# EasyEDA schematic SCH_TauKeyboard-87keys.SchDoc_2023-11-22.json

## Parts
C2  47uF  [3528_C]
C3  2.2uF  [0402_C]
C5  0.1uF  [0402_C]
C6  2.2uF  [0603_C]
C7  2.2uF  [0402_C]
C8  2.2uF  [0603_C]
C9  2.2uF  [0603_C]
C10  20pF  [0603_C]
C11  0.1uF  [0603_C]
C12  33uF  [3528_C]
C13  10uF  [3216_C]
C14  0.1uF  [0603_C]
D1  DIODE  [3216+]
D2  DIODE  [3216+]
D3  DIODE  [3216+]
D4  DIODE  [3216+]
D5  DIODE  [3216+]
D6  DIODE  [3216+]
D7  DIODE  [3216+]
D8  DIODE  [3216+]
D9  DIODE  [3216+]
D10  DIODE  [3216+]
D11  DIODE  [3216+]
D12  DIODE  [3216+]
D13  DIODE  [3216+]
D14  DIODE  [3216+]
D15  DIODE  [3216+]
D16  DIODE  [3216+]
D17  DIODE  [3216+]
D18  DIODE  [3216+]
D19  DIODE  [3216+]
D20  DIODE  [3216+]
D21  DIODE  [3216+]
D22  1N5817  [7227+]
D23  DIODE  [3216+]
D24  1N5817  [7227+]
D25  DIODE  [3216+]
D26  1N5817  [7227+]
D27  DIODE  [3216+]
D28  DIODE  [3216+]
D29  DIODE  [3216+]
D30  DIODE  [3216+]
D31  DIODE  [3216+]
D32  DIODE  [3216+]
D33  DIODE  [3216+]
D34  DIODE  [3216+]
D35  DIODE  [3216+]
D36  DIODE  [3216+]
D37  DIODE  [3216+]
D38  DIODE  [3216+]
D39  DIODE  [3216+]
D40  DIODE  [3216+]
D41  DIODE  [3216+]
D42  DIODE  [3216+]
D43  DIODE  [3216+]
D44  DIODE  [3216+]
D45  DIODE  [3216+]
D46  DIODE  [3216+]
D47  DIODE  [3216+]
D48  DIODE  [3216+]
D49  DIODE  [3216+]
D50  DIODE  [3216+]
D51  DIODE  [3216+]
D52  DIODE  [3216+]
D53  DIODE  [3216+]
D54  DIODE  [3216+]
D55  DIODE  [3216+]
D56  DIODE  [3216+]
D57  DIODE  [3216+]
D58  DIODE  [3216+]
D59  DIODE  [3216+]
D60  DIODE  [3216+]
D61  DIODE  [3216+]
D62  DIODE  [3216+]
D63  DIODE  [3216+]
D64  DIODE  [3216+]
D65  DIODE  [3216+]
D66  DIODE  [3216+]
D67  DIODE  [3216+]
D68  DIODE  [3216+]
D69  DIODE  [3216+]
D70  DIODE  [3216+]
D71  DIODE  [3216+]
D72  DIODE  [3216+]
D73  DIODE  [3216+]
D74  DIODE  [3216+]
D75  DIODE  [3216+]
D76  DIODE  [3216+]
D77  DIODE  [3216+]
D78  DIODE  [3216+]
D79  DIODE  [3216+]
D80  DIODE  [3216+]
D81  DIODE  [3216+]
D82  DIODE  [3216+]
D83  DIODE  [3216+]
D84  DIODE  [3216+]
D85  DIODE  [3216+]
D86  DIODE  [3216+]
D87  DIODE  [3216+]
D88  DIODE  [3216+]
D89  DIODE  [3216+]
D90  DIODE  [3216+]
D199  LED  [0603+]
D227  LED  [0603+]
D228  LED  [0603+]
D229  LED  [0603+]
E1  ANTENNA  [ANT-F-1-2.4G-1.6]
J1  电源  [SIP2-2.54MM]
L1  22uH  [SMD_7.3X7.8MM]
L2  22uH  [SMD_2X2MM]
L4  3.3uH  [SMD_5X5MM]
LD7  LED  [0603+]
LD8  LED  [0603+]
LD9  LED  [0603+]
LD10  LED  [0603+]
LD11  LED  [0603+]
LD12  LED  [0603+]
LD13  LED  [0603+]
LD14  LED  [0603+]
LD15  LED  [0603+]
LD16  LED  [0603+]
LD17  LED  [0603+]
LD18  LED  [0603+]
LD19  LED  [0603+]
LD21  LED  [0603+]
LD22  LED  [0603+]
LD23  LED  [0603+]
LD52  LED  [0603+]
LD53  LED  [0603+]
LD54  LED  [0603+]
LD55  LED  [0603+]
LD56  LED  [0603+]
LD57  LED  [0603+]
LD58  LED  [0603+]
LD59  LED  [0603+]
LD60  LED  [0603+]
LD61  LED  [0603+]
LD62  LED  [0603+]
LD63  LED  [0603+]
LD64  LED  [0603+]
LD65  LED  [0603+]
LD66  LED  [0603+]
LD67  LED  [0603+]
LD68  LED  [0603+]
LD93  LED  [0603+]
LD94  LED  [0603+]
LD95  LED  [0603+]
LD96  LED  [0603+]
LD97  LED  [0603+]
LD98  LED  [0603+]
LD99  LED  [0603+]
LD100  LED  [0603+]
LD101  LED  [0603+]
LD102  LED  [0603+]
LD103  LED  [0603+]
LD104  LED  [0603+]
LD105  LED  [0603+]
LD106  LED  [0603+]
LD107  LED  [0603+]
LD108  LED  [0603+]
LD109  LED  [0603+]
LD140  LED  [0603+]
LD141  LED  [0603+]
LD142  LED  [0603+]
LD143  LED  [0603+]
LD144  LED  [0603+]
LD145  LED  [0603+]
LD146  LED  [0603+]
LD147  LED  [0603+]
LD148  LED  [0603+]
LD149  LED  [0603+]
LD150  LED  [0603+]
LD151  LED  [0603+]
LD186  LED  [0603+]
LD187  LED  [0603+]
LD188  LED  [0603+]
LD189  LED  [0603+]
LD190  LED  [0603+]
LD191  LED  [0603+]
LD192  LED  [0603+]
LD193  LED  [0603+]
LD194  LED  [0603+]
LD195  LED  [0603+]
LD196  LED  [0603+]
LD197  LED  [0603+]
LD216  LED  [0603+]
LD217  LED  [0603+]
LD218  LED  [0603+]
LD219  LED  [0603+]
LD220  LED  [0603+]
LD223  LED  [0603+]
LD224  LED  [0603+]
LD230  LED  [0603+]
LD231  LED  [0603+]
LD232  LED  [0603+]
LD_FN  LED  [0603+]
P6  Header 2  [SIP2-2.54MM]
P7  Header 4  [HDR1X4]
P7#2  Header 2  [SIP2-2.54MM]
P9  TYPE-C  [TYPE-C-RECEPTACLE-2.0]
Q1  MOSFET P  [SOT-23]
Q2  MOSFET P  [SOT-23]
Q3  MOSFET P  [SOT-23]
Q4  MOSFET P  [SOT-23]
Q5  MOSFET P  [SOT-23]
Q6  MOSFET P  [SOT-23]
R1  0R  [0603]
R2  0R  [0603]
R3  0R  [0603]
R4  0R  [0603]
R5  0R  [0603]
R6  0R  [0603]
R7  0R  [0603]
R8  0R  [0603]
R9  0R  [0603]
R10  0R  [0603]
R10#2  NC(5.1K)  [0603]
R11  0R  [0603]
R11#2  NC(5.1K)  [0603]
R12  0R  [0603]
R13  0R  [0603]
R14  0R  [0603]
R16  0R  [0603]
R17  0R  [0603]
R18  0R  [0603]
R24  0R  [0603]
R25  0R  [0603]
R26  0R  [0603]
R27  0R  [0603]
R28  0R  [0603]
R29  0R  [0603]
R30  0R  [0603]
R31  0R  [0603]
R32  0R  [0603]
R33  0R  [0603]
R34  0R  [0603]
R35  0R  [0603]
R36  0R  [0603]
R37  0R  [0603]
R38  0R  [0603]
R39  0R  [0603]
R40  0R  [0603]
R41  0R  [0603]
R47  0R  [0603]
R48  0R  [0603]
R49  0R  [0603]
R50  0R  [0603]
R51  0R  [0603]
R52  0R  [0603]
R53  0R  [0603]
R54  0R  [0603]
R55  0R  [0603]
R56  0R  [0603]
R57  0R  [0603]
R58  0R  [0603]
R59  0R  [0603]
R60  0R  [0603]
R61  0R  [0603]
R62  0R  [0603]
R63  0R  [0603]
R64  0R  [0603]
R70  0R  [0603]
R72  0R  [0603]
R73  0R  [0603]
R74  0R  [0603]
R75  0R  [0603]
R76  0R  [0603]
R77  0R  [0603]
R78  0R  [0603]
R79  0R  [0603]
R80  0R  [0603]
R81  0R  [0603]
R82  0R  [0603]
R83  0R  [0603]
R90  0R  [0603]
R91  0R  [0603]
R92  0R  [0603]
R93  0R  [0603]
R94  0R  [0603]
R95  0R  [0603]
R96  0R  [0603]
R97  0R  [0603]
R98  0R  [0603]
R99  0R  [0603]
R100  0R  [0603]
R101  0R  [0603]
R102  0R  [0603]
R104  0R  [0603]
R110  0R  [0603]
R111  0R  [0603]
R112  0R  [0603]
R113  0R  [0603]
R114  0R  [0603]
R115  0R  [0603]
R117  1K  [0603]
R118  0R  [0603]
R119  0R  [0603]
R120  10K  [0603]
R121  1M  [0603]
R122  0R  [0603]
R123  0R  [0603]
R124  0R  [0603]
R126  1K  [0603]
R127  1K  [0603]
R128  10K  [0603]
R129  1M  [0603]
R131  47K  [0603]
R133  10K  [0603]
R135  1K  [0603]
R300  10K  [0603]
R_FN  0R  [0603]
RJ1  10K  [0603]
RJ2  10K  [0603]
RJ3  10K  [0603]
RJ4  10K  [0603]
RJ5  10K  [0603]
RJ6  10K  [0603]
RJ7  10K  [0603]
RJ8  10K  [0603]
RJ9  10K  [0603]
RJ10  10K  [0603]
RJ11  10K  [0603]
RJ12  10K  [0603]
RJ13  10K  [0603]
RJ14  10K  [0603]
RJ15  10K  [0603]
RJ16  10K  [0603]
RJ17  10K  [0603]
S1  SW-PB  [SMD_6.1X3.65X2.5MM-KEY]
S2  SW-PB  [SMD_6.1X3.65X2.5MM-KEY]
S3  SW-PB  [SMD_6.1X3.65X2.5MM-KEY]
S4  SW-PB  [SMD_6.1X3.65X2.5MM-KEY]
S5  SW-PB  [SMD_6.1X3.65X2.5MM-KEY]
S6  SW-PB  [SMD_6.1X3.65X2.5MM-KEY]
S7  SW-PB  [SMD_6.1X3.65X2.5MM-KEY]
S8  SW-PB  [SMD_6.1X3.65X2.5MM-KEY]
S9  SW-PB  [SMD_6.1X3.65X2.5MM-KEY]
S10  SW-PB  [SMD_6.1X3.65X2.5MM-KEY]
S11  SW-PB  [SMD_6.1X3.65X2.5MM-KEY]
S12  SW-PB  [SMD_6.1X3.65X2.5MM-KEY]
S13  SW-PB  [SMD_6.1X3.65X2.5MM-KEY]
S14  SW-PB  [SMD_6.1X3.65X2.5MM-KEY]
S15  SW-PB  [SMD_6.1X3.65X2.5MM-KEY]
S16  SW-PB  [SMD_6.1X3.65X2.5MM-KEY]
S17  SW-PB  [SMD_6.1X3.65X2.5MM-KEY]
S18  SW-PB  [SMD_6.1X3.65X2.5MM-KEY]
S19  SW-PB  [SMD_6.1X3.65X2.5MM-KEY]
S20  SW-PB  [SMD_6.1X3.65X2.5MM-KEY]
S21  SW-PB  [SMD_6.1X3.65X2.5MM-KEY]
S22  SW-PB  [SMD_6.1X3.65X2.5MM-KEY]
S23  SW-PB  [SMD_6.1X3.65X2.5MM-KEY]
S24  SW-PB  [SMD_6.1X3.65X2.5MM-KEY]
S25  SW-PB  [SMD_6.1X3.65X2.5MM-KEY]
S26  SW-PB  [SMD_6.1X3.65X2.5MM-KEY]
S27  SW-PB  [SMD_6.1X3.65X2.5MM-KEY]
S28  SW-PB  [SMD_6.1X3.65X2.5MM-KEY]
S29  SW-PB  [SMD_6.1X3.65X2.5MM-KEY]
S30  SW-PB  [SMD_6.1X3.65X2.5MM-KEY]
S31  SW-PB  [SMD_6.1X3.65X2.5MM-KEY]
S32  SW-PB  [SMD_6.1X3.65X2.5MM-KEY]
S33  SW-PB  [SMD_6.1X3.65X2.5MM-KEY]
S34  SW-PB  [SMD_6.1X3.65X2.5MM-KEY]
S35  SW-PB  [SMD_6.1X3.65X2.5MM-KEY]
S36  SW-PB  [SMD_6.1X3.65X2.5MM-KEY]
S37  SW-PB  [SMD_6.1X3.65X2.5MM-KEY]
S38  SW-PB  [SMD_6.1X3.65X2.5MM-KEY]
S39  SW-PB  [SMD_6.1X3.65X2.5MM-KEY]
S40  SW-PB  [SMD_6.1X3.65X2.5MM-KEY]
S41  SW-PB  [SMD_6.1X3.65X2.5MM-KEY]
S42  SW-PB  [SMD_6.1X3.65X2.5MM-KEY]
S43  SW-PB  [SMD_6.1X3.65X2.5MM-KEY]
S44  SW-PB  [SMD_6.1X3.65X2.5MM-KEY]
S45  SW-PB  [SMD_6.1X3.65X2.5MM-KEY]
S46  SW-PB  [SMD_6.1X3.65X2.5MM-KEY]
S47  SW-PB  [SMD_6.1X3.65X2.5MM-KEY]
S48  SW-PB  [SMD_6.1X3.65X2.5MM-KEY]
S49  SW-PB  [SMD_6.1X3.65X2.5MM-KEY]
S50  SW-PB  [SMD_6.1X3.65X2.5MM-KEY]
S51  SW-PB  [SMD_6.1X3.65X2.5MM-KEY]
S52  SW-PB  [SMD_6.1X3.65X2.5MM-KEY]
S53  SW-PB  [SMD_6.1X3.65X2.5MM-KEY]
S54  SW-PB  [SMD_6.1X3.65X2.5MM-KEY]
S55  SW-PB  [SMD_6.1X3.65X2.5MM-KEY]
S56  SW-PB  [SMD_6.1X3.65X2.5MM-KEY]
S57  SW-PB  [SMD_6.1X3.65X2.5MM-KEY]
S58  SW-PB  [SMD_6.1X3.65X2.5MM-KEY]
S59  SW-PB  [SMD_6.1X3.65X2.5MM-KEY]
S60  SW-PB  [SMD_6.1X3.65X2.5MM-KEY]
S61  SW-PB  [SMD_6.1X3.65X2.5MM-KEY]
S62  SW-PB  [SMD_6.1X3.65X2.5MM-KEY]
S63  SW-PB  [SMD_6.1X3.65X2.5MM-KEY]
S64  SW-PB  [SMD_6.1X3.65X2.5MM-KEY]
S65  SW-PB  [SMD_6.1X3.65X2.5MM-KEY]
S66  SW-PB  [SMD_6.1X3.65X2.5MM-KEY]
S67  SW-PB  [SMD_6.1X3.65X2.5MM-KEY]
S68  SW-PB  [SMD_6.1X3.65X2.5MM-KEY]
S69  SW-PB  [SMD_6.1X3.65X2.5MM-KEY]
S70  Download  [____]
S71  SW-PB  [SMD_6.1X3.65X2.5MM-KEY]
S72  SW-PB  [SMD_6.1X3.65X2.5MM-KEY]
S73  SW-PB  [SMD_6.1X3.65X2.5MM-KEY]
S74  SW-PB  [SMD_6.1X3.65X2.5MM-KEY]
S75  SW-PB  [SMD_6.1X3.65X2.5MM-KEY]
S76  SW-PB  [SMD_6.1X3.65X2.5MM-KEY]
S77  SW-PB  [SMD_6.1X3.65X2.5MM-KEY]
S78  SW-PB  [SMD_6.1X3.65X2.5MM-KEY]
S79  SW-PB  [SMD_6.1X3.65X2.5MM-KEY]
S80  SW-PB  [SMD_6.1X3.65X2.5MM-KEY]
S81  SW-PB  [SMD_6.1X3.65X2.5MM-KEY]
S82  SW-PB  [SMD_6.1X3.65X2.5MM-KEY]
S83  SW-PB  [SMD_6.1X3.65X2.5MM-KEY]
S84  SW-PB  [SMD_6.1X3.65X2.5MM-KEY]
S85  SW-PB  [SMD_6.1X3.65X2.5MM-KEY]
S86  SW-PB  [SMD_6.1X3.65X2.5MM-KEY]
S87  SW-PB  [SMD_6.1X3.65X2.5MM-KEY]
S_FN1  SW-PB  [SMD_6.1X3.65X2.5MM-KEY]
U1  CE8301C33M  [SOT-23-5]
U2  CH582M  [QFN48_5X5]
U3  CE8502AM  [SOT-23-5]
Y1  32M  [XT3225]
Y2  32.768K  [FC-135]

## Library data of the parts
D22 D24 D26 = -: Published: 8-Jun-2000; LatestRevisionDate: 17-Jul-2002; LatestRevisionNote: Re-released for DXP Platform.; PackageReference: SMB; Publisher: Altium Limited; Code_JEDEC: DO-214-AA
L1 = -: 物料代码: 1.05.0226.04; 物料名称: 电感; Value2: 额定电流600mA; Value3: 顺络
P6 P7 P7#2 = -: LatestRevisionDate: 17-Jul-2002; LatestRevisionNote: Re-released for DXP Platform.; Publisher: Altium Limited
RJ1-RJ17 = -: Published: 8-Jun-2000; LatestRevisionDate: 17-Jul-2002; LatestRevisionNote: Re-released for DXP Platform.; PackageReference: AXIAL-0.4; Publisher: Altium Limited
S70 = -: Published: 24-Mar-1999; LatestRevisionDate: 17-Jul-2002; LatestRevisionNote: Re-released for DXP Platform.; PackageReference: SPST-2; Publisher: Altium Limited; PackageDescription: Switch; 2 Leads
U1 = -: 物料代码: 1.07.0021.05; 物料名称: IC
Y1 Y2 = -: Published: 8-Jun-2000; LatestRevisionDate: 17-Jul-2002; LatestRevisionNote: Re-released for DXP Platform.; PackageReference: R38; Publisher: Altium Limited; PackageDescription: Crystal, Thru-Hole; 2 Leads; Body 3.1 x 8.2 mm (Dia.xH)

## Nets
+3V3: C6.2 D24.2(K) D26.2(K) LD230.A(1) LD231.A(1) LD232.A(1) P7.1 R300.2 U2.3(VIO33/VDD33)
+5V: C13.1 D199.A(1) D227.A(1) D228.A(1) D229.A(1) LD7.A(1) LD8.A(1) LD9.A(1) LD10.A(1) LD11.A(1) LD12.A(1) LD13.A(1) LD14.A(1) LD15.A(1) LD16.A(1) LD17.A(1) LD18.A(1) LD19.A(1) LD21.A(1) LD22.A(1) LD23.A(1) LD52.A(1) LD53.A(1) LD54.A(1) LD55.A(1) LD56.A(1) LD57.A(1) LD58.A(1) LD59.A(1) LD60.A(1) LD61.A(1) LD62.A(1) LD63.A(1) LD64.A(1) LD65.A(1) LD66.A(1) LD67.A(1) LD68.A(1) LD93.A(1) LD94.A(1) LD95.A(1) LD96.A(1) LD97.A(1) LD98.A(1) LD99.A(1) LD100.A(1) LD101.A(1) LD102.A(1) LD103.A(1) LD104.A(1) LD105.A(1) LD106.A(1) LD107.A(1) LD108.A(1) LD109.A(1) LD140.A(1) LD141.A(1) LD142.A(1) LD143.A(1) LD144.A(1) LD145.A(1) LD146.A(1) LD147.A(1) LD148.A(1) LD149.A(1) LD150.A(1) LD151.A(1) LD186.A(1) LD187.A(1) LD188.A(1) LD189.A(1) LD190.A(1) LD191.A(1) LD192.A(1) LD193.A(1) LD194.A(1) LD195.A(1) LD196.A(1) LD197.A(1) LD216.A(1) LD217.A(1) LD218.A(1) LD219.A(1) LD220.A(1) LD223.A(1) LD224.A(1) LD_FN.A(1) P9.A4(VBUS) P9.B4(VBUS) R120.2 U3.1(RUN) U3.4(VIN)
VINTA: C7.2 U2.33(VINTA)
BT+: C2.2 J1.2 L1.1 R117.2 R121.2
BT-: C2.1 C3.1 C5.1 C6.1 C7.1 C8.1 C9.1 C11.2 C12.2 C13.2 C14.1 J1.1 P7.4 P7#2.2 P9.A1(GND) P9.B1(GND) Q1.3(D) Q2.3(D) Q3.3(D) Q4.3(D) Q5.3(D) Q6.3(D) R10#2.2 R11#2.2 R128.1 R129.1 R133.1 RJ1.1 RJ2.1 RJ3.1 RJ4.1 RJ5.1 RJ6.1 RJ7.1 RJ8.1 RJ9.1 RJ10.1 RJ11.1 RJ12.1 RJ13.1 RJ14.1 RJ15.1 RJ16.1 RJ17.1 U1.4(GND) U2.0(GND) U3.2(GND)
CL0: D1.2(K) D7.2(K) D13.2(K) D19.2(K) D28.2(K) D34.2(K) RJ1.2 U2.20(PB4/RXD0/PWM7)
CL1: D2.2(K) D8.2(K) D14.2(K) D20.2(K) D29.2(K) D35.2(K) RJ2.2 U2.19(PB5/DTR)
CL2: D3.2(K) D9.2(K) D15.2(K) D21.2(K) D30.2(K) D36.2(K) RJ3.2 U2.18(PB6/RTS/PWM8)
CL3: D4.2(K) D10.2(K) D16.2(K) D23.2(K) D31.2(K) D37.2(K) RJ4.2 U2.17(PB7/TXD0/PWM9)
CL4: D5.2(K) D11.2(K) D17.2(K) D25.2(K) D32.2(K) D38.2(K) RJ5.2 U2.12(PB14/TIO/DSR_/MOSI_/PWM10)
CL5: D6.2(K) D12.2(K) D18.2(K) D27.2(K) D33.2(K) D39.2(K) RJ6.2 U2.11(PB15/TCK/MISO_/DTR_)
CL6: D40.2(K) D47.2(K) D54.2(K) D61.2(K) D68.2(K) RJ7.2 U2.10(PB16)
CL7: D41.2(K) D48.2(K) D55.2(K) D62.2(K) D69.2(K) D74.2(K) RJ8.2 U2.9(PB17)
CL8: D42.2(K) D49.2(K) D56.2(K) D63.2(K) D70.2(K) D75.2(K) RJ9.2 U2.8(PB8)
CL9: D43.2(K) D50.2(K) D57.2(K) D64.2(K) D71.2(K) RJ10.2 U2.7(PB9)
CL10: D44.2(K) D51.2(K) D58.2(K) D65.2(K) D72.2(K) RJ11.2 U2.5(PA8/RXD1/AIN12)
CL11: D45.2(K) D52.2(K) D59.2(K) D66.2(K) D73.2(K) RJ12.2 U2.30(PB18)
CL12: D46.2(K) D53.2(K) D60.2(K) D67.2(K) RJ13.2 U2.29(PB19)
CL13: D79.2(K) D86.2(K) RJ14.2 U2.28(PB20/SDA_/RXD3_)
CL14: D76.2(K) D80.2(K) D83.2(K) D88.2(K) RJ15.2 U2.27(PB21/SCL_/TXD3_)
CL15: D77.2(K) D81.2(K) D84.2(K) D87.2(K) D89.2(K) RJ16.2 U2.26(PB22/TMR3/RXD2_)
CL16: D78.2(K) D82.2(K) D85.2(K) D90.2(K) RJ17.2 U2.25(PB23/RST/TMR0_/TXD2_/PWM11)
LED_CAP: R127.2 U2.46(PA12/SCS/PWM4/AIN2)
LED_NUM: P7.2 R126.2 U2.13(PB13/U2D+/SCK0_/SCL/TXD1_)
LED_SCR: P7.3 R135.2 U2.14(PB12/U2D-/SCS_/SDA/RXD1_)
LLQ1: Q1.2(S) R1.2
LLQ2: Q2.2(S) R24.2
LLQ3: Q3.2(S) R47.2
LLQ4: Q4.2(S) R70.2
LLQ5: Q5.2(S) R90.2
LLQ6: Q6.2(S) R110.2
LR0: Q1.1(G) U2.38(PA6/RXD2/PWM4_/AIN10)
LR1: Q2.1(G) U2.4(PA7/TXD2/PWM5_/AIN11)
LR2: Q3.1(G) U2.24(PB0/CTS/PWM6)
LR3: Q4.1(G) U2.23(PB1/DSR/PWM7_)
LR4: Q5.1(G) U2.22(PB2/RI/PWM8_)
LR5: Q6.1(G) U2.21(PB3/DCD/PWM9_)
PA0: S1.1 S2.1 S3.1 S4.1 S5.1 S6.1 S36.1 S37.1 S38.1 S39.1 S40.1 S41.1 S42.1 S73.1 S74.1 S75.1 U2.39(PA0/AIN9)
PA1: S7.1 S8.1 S9.1 S10.1 S11.1 S12.1 S43.1 S44.1 S45.1 S46.1 S47.1 S48.1 S49.1 S76.1 S77.1 S78.1 S79.1 U2.40(PA1/AIN8)
PA2: S13.1 S14.1 S15.1 S16.1 S17.1 S18.1 S50.1 S51.1 S52.1 S53.1 S54.1 S55.1 S56.1 S80.1 S81.1 S82.1 U2.41(PA2/TMR3_/AIN7)
PA3: S19.1 S20.1 S21.1 S22.1 S23.1 S24.1 S57.1 S58.1 S59.1 S60.1 S61.1 S62.1 S63.1 S83.1 U2.42(PA3/AIN6)
PA4: S25.1 S26.1 S27.1 S28.1 S29.1 S30.1 S64.1 S65.1 S66.1 S67.1 S68.1 S69.1 S84.1 U2.36(PA4/RXD3/AIN0)
PA5: S31.1 S32.1 S33.1 S34.1 S35.1 S71.1 S72.1 S85.1 S86.1 S87.1 S_FN1.1 U2.37(PA5/TXD3/AIN1)
PA9: P7#2.1 U2.6(PA9/TMR0/TXD1/AIN13)
PA10: U2.48(PA10/X32KI/TMR1) Y2.2(OSC2)
PA11: U2.47(PA11/X32KO/TMR2) Y2.1(OSC1)
PA13: C5.2 R121.1 R129.2 U2.45(PA13/SCK0/PWM5/AIN3)
PA14: R117.1 U1.1(EN) U2.44(PA14/MOSI/TXD0_/AIN4)
PA15: R120.1 R128.2 U2.43(PA15/MISO/RXD0_/AIN5)
UD+: P6.2 P9.A6(D+) P9.B6(D+) S70.3 U2.15(PB11/UD+/TMR2_)
UD-: P9.A7(D-) P9.B7(D-) U2.16(PB10/UD-/TMR1_)
VDCIA: C8.2 C9.2 C14.2 L2.2 U2.1(VDCID) U2.35(VDCIA)
X32MI: U2.32(X32MI) Y1.3(OSC2)
X32MO: U2.31(X32MO) Y1.1(OSC1)
Net-(C3-2): C3.2 D22.2(K) D24.1(A) U1.2(VOUT)
Net-(C10-1): C10.1 C11.1 C12.1 D26.1(A) L4.2 R131.1
Net-(C10-2): C10.2 R131.2 R133.2 U3.5(FB/VOUT)
Net-(D1-1): D1.1(A) S1.2
Net-(D2-1): D2.1(A) S2.2
Net-(D3-1): D3.1(A) S3.2
Net-(D4-1): D4.1(A) S4.2
Net-(D5-1): D5.1(A) S5.2
Net-(D6-1): D6.1(A) S6.2
Net-(D7-1): D7.1(A) S7.2
Net-(D8-1): D8.1(A) S8.2
Net-(D9-1): D9.1(A) S9.2
Net-(D10-1): D10.1(A) S10.2
Net-(D11-1): D11.1(A) S11.2
Net-(D12-1): D12.1(A) S12.2
Net-(D13-1): D13.1(A) S13.2
Net-(D14-1): D14.1(A) S14.2
Net-(D15-1): D15.1(A) S15.2
Net-(D16-1): D16.1(A) S16.2
Net-(D17-1): D17.1(A) S17.2
Net-(D18-1): D18.1(A) S18.2
Net-(D19-1): D19.1(A) S19.2
Net-(D20-1): D20.1(A) S20.2
Net-(D21-1): D21.1(A) S21.2
Net-(D22-1): D22.1(A) L1.2 U1.5(LX)
Net-(D23-1): D23.1(A) S22.2
Net-(D25-1): D25.1(A) S23.2
Net-(D27-1): D27.1(A) S24.2
Net-(D28-1): D28.1(A) S25.2
Net-(D29-1): D29.1(A) S26.2
Net-(D30-1): D30.1(A) S27.2
Net-(D31-1): D31.1(A) S28.2
Net-(D32-1): D32.1(A) S29.2
Net-(D33-1): D33.1(A) S30.2
Net-(D34-1): D34.1(A) S31.2
Net-(D35-1): D35.1(A) S32.2
Net-(D36-1): D36.1(A) S33.2
Net-(D37-1): D37.1(A) S34.2
Net-(D38-1): D38.1(A) S35.2
Net-(D39-1): D39.1(A) S_FN1.2
Net-(D40-1): D40.1(A) S36.2
Net-(D41-1): D41.1(A) S37.2
Net-(D42-1): D42.1(A) S38.2
Net-(D43-1): D43.1(A) S39.2
Net-(D44-1): D44.1(A) S40.2
Net-(D45-1): D45.1(A) S41.2
Net-(D46-1): D46.1(A) S42.2
Net-(D47-1): D47.1(A) S43.2
Net-(D48-1): D48.1(A) S44.2
Net-(D49-1): D49.1(A) S45.2
Net-(D50-1): D50.1(A) S46.2
Net-(D51-1): D51.1(A) S47.2
Net-(D52-1): D52.1(A) S48.2
Net-(D53-1): D53.1(A) S49.2
Net-(D54-1): D54.1(A) S50.2
Net-(D55-1): D55.1(A) S51.2
Net-(D56-1): D56.1(A) S52.2
Net-(D57-1): D57.1(A) S53.2
Net-(D58-1): D58.1(A) S54.2
Net-(D59-1): D59.1(A) S55.2
Net-(D60-1): D60.1(A) S56.2
Net-(D61-1): D61.1(A) S57.2
Net-(D62-1): D62.1(A) S58.2
Net-(D63-1): D63.1(A) S59.2
Net-(D64-1): D64.1(A) S60.2
Net-(D65-1): D65.1(A) S61.2
Net-(D66-1): D66.1(A) S62.2
Net-(D67-1): D67.1(A) S63.2
Net-(D68-1): D68.1(A) S64.2
Net-(D69-1): D69.1(A) S65.2
Net-(D70-1): D70.1(A) S66.2
Net-(D71-1): D71.1(A) S67.2
Net-(D72-1): D72.1(A) S68.2
Net-(D73-1): D73.1(A) S69.2
Net-(D74-1): D74.1(A) S71.2
Net-(D75-1): D75.1(A) S72.2
Net-(D76-1): D76.1(A) S73.2
Net-(D77-1): D77.1(A) S74.2
Net-(D78-1): D78.1(A) S75.2
Net-(D79-1): D79.1(A) S76.2
Net-(D80-1): D80.1(A) S77.2
Net-(D81-1): D81.1(A) S78.2
Net-(D82-1): D82.1(A) S79.2
Net-(D83-1): D83.1(A) S80.2
Net-(D84-1): D84.1(A) S81.2
Net-(D85-1): D85.1(A) S82.2
Net-(D86-1): D86.1(A) S83.2
Net-(D87-1): D87.1(A) S84.2
Net-(D88-1): D88.1(A) S85.2
Net-(D89-1): D89.1(A) S86.2
Net-(D90-1): D90.1(A) S87.2
Net-(D199-K): D199.K(2) R104.1
Net-(D227-K): D227.K(2) R122.1
Net-(D228-K): D228.K(2) R123.1
Net-(D229-K): D229.K(2) R124.1
Net-(E1-1): E1.1(A) U2.34(ANT)
Net-(L2-1): L2.1 U2.2(VSW)
Net-(L4-1): L4.1 U3.3(SW)
Net-(LD7-K): LD7.K(2) R2.1
Net-(LD8-K): LD8.K(2) R3.1
Net-(LD9-K): LD9.K(2) R4.1
Net-(LD10-K): LD10.K(2) R5.1
Net-(LD11-K): LD11.K(2) R6.1
Net-(LD12-K): LD12.K(2) R7.1
Net-(LD13-K): LD13.K(2) R8.1
Net-(LD14-K): LD14.K(2) R9.1
Net-(LD15-K): LD15.K(2) R10.1
Net-(LD16-K): LD16.K(2) R11.1
Net-(LD17-K): LD17.K(2) R12.1
Net-(LD18-K): LD18.K(2) R13.1
Net-(LD19-K): LD19.K(2) R14.1
Net-(LD21-K): LD21.K(2) R16.1
Net-(LD22-K): LD22.K(2) R17.1
Net-(LD23-K): LD23.K(2) R18.1
Net-(LD52-K): LD52.K(2) R25.1
Net-(LD53-K): LD53.K(2) R26.1
Net-(LD54-K): LD54.K(2) R27.1
Net-(LD55-K): LD55.K(2) R28.1
Net-(LD56-K): LD56.K(2) R29.1
Net-(LD57-K): LD57.K(2) R30.1
Net-(LD58-K): LD58.K(2) R31.1
Net-(LD59-K): LD59.K(2) R32.1
Net-(LD60-K): LD60.K(2) R33.1
Net-(LD61-K): LD61.K(2) R34.1
Net-(LD62-K): LD62.K(2) R35.1
Net-(LD63-K): LD63.K(2) R36.1
Net-(LD64-K): LD64.K(2) R37.1
Net-(LD65-K): LD65.K(2) R38.1
Net-(LD66-K): LD66.K(2) R39.1
Net-(LD67-K): LD67.K(2) R40.1
Net-(LD68-K): LD68.K(2) R41.1
Net-(LD93-K): LD93.K(2) R48.1
Net-(LD94-K): LD94.K(2) R49.1
Net-(LD95-K): LD95.K(2) R50.1
Net-(LD96-K): LD96.K(2) R51.1
Net-(LD97-K): LD97.K(2) R52.1
Net-(LD98-K): LD98.K(2) R53.1
Net-(LD99-K): LD99.K(2) R54.1
Net-(LD100-K): LD100.K(2) R55.1
Net-(LD101-K): LD101.K(2) R56.1
Net-(LD102-K): LD102.K(2) R57.1
Net-(LD103-K): LD103.K(2) R58.1
Net-(LD104-K): LD104.K(2) R59.1
Net-(LD105-K): LD105.K(2) R60.1
Net-(LD106-K): LD106.K(2) R61.1
Net-(LD107-K): LD107.K(2) R62.1
Net-(LD108-K): LD108.K(2) R63.1
Net-(LD109-K): LD109.K(2) R64.1
Net-(LD140-K): LD140.K(2) R72.1
Net-(LD141-K): LD141.K(2) R73.1
Net-(LD142-K): LD142.K(2) R74.1
Net-(LD143-K): LD143.K(2) R75.1
Net-(LD144-K): LD144.K(2) R76.1
Net-(LD145-K): LD145.K(2) R77.1
Net-(LD146-K): LD146.K(2) R78.1
Net-(LD147-K): LD147.K(2) R79.1
Net-(LD148-K): LD148.K(2) R80.1
Net-(LD149-K): LD149.K(2) R81.1
Net-(LD150-K): LD150.K(2) R82.1
Net-(LD151-K): LD151.K(2) R83.1
Net-(LD186-K): LD186.K(2) R91.1
Net-(LD187-K): LD187.K(2) R92.1
Net-(LD188-K): LD188.K(2) R93.1
Net-(LD189-K): LD189.K(2) R94.1
Net-(LD190-K): LD190.K(2) R95.1
Net-(LD191-K): LD191.K(2) R96.1
Net-(LD192-K): LD192.K(2) R97.1
Net-(LD193-K): LD193.K(2) R98.1
Net-(LD194-K): LD194.K(2) R99.1
Net-(LD195-K): LD195.K(2) R100.1
Net-(LD196-K): LD196.K(2) R101.1
Net-(LD197-K): LD197.K(2) R102.1
Net-(LD216-K): LD216.K(2) R111.1
Net-(LD217-K): LD217.K(2) R112.1
Net-(LD218-K): LD218.K(2) R113.1
Net-(LD219-K): LD219.K(2) R114.1
Net-(LD220-K): LD220.K(2) R115.1
Net-(LD223-K): LD223.K(2) R118.1
Net-(LD224-K): LD224.K(2) R119.1
Net-(LD230-K): LD230.K(2) R126.1
Net-(LD231-K): LD231.K(2) R127.1
Net-(LD232-K): LD232.K(2) R135.1
Net-(LD_FN-K): LD_FN.K(2) R_FN.1
Net-(P6-1): P6.1 R300.1 S70.1
Net-(P9-A5): P9.A5(CC) R10#2.1
Net-(P9-B5): P9.B5(CC) R11#2.1
Net-(R1-1): R1.1 R2.2 R3.2 R4.2 R5.2 R6.2 R7.2 R8.2 R9.2 R10.2 R11.2 R12.2 R13.2 R14.2 R16.2 R17.2 R18.2
Net-(R24-1): R24.1 R25.2 R26.2 R27.2 R28.2 R29.2 R30.2 R31.2 R32.2 R33.2 R34.2 R35.2 R36.2 R37.2 R38.2 R39.2 R40.2 R41.2
Net-(R47-1): R47.1 R48.2 R49.2 R50.2 R51.2 R52.2 R53.2 R54.2 R55.2 R56.2 R57.2 R58.2 R59.2 R60.2 R61.2 R62.2 R63.2 R64.2
Net-(R70-1): R70.1 R72.2 R73.2 R74.2 R75.2 R76.2 R77.2 R78.2 R79.2 R80.2 R81.2 R82.2 R83.2
Net-(R90-1): R90.1 R91.2 R92.2 R93.2 R94.2 R95.2 R96.2 R97.2 R98.2 R99.2 R100.2 R101.2 R102.2 R104.2
Net-(R110-1): R110.1 R111.2 R112.2 R113.2 R114.2 R115.2 R118.2 R119.2 R122.2 R123.2 R124.2 R_FN.2

Not connected (* = marked no-connect by the designer): P9 A8(RFU1)* B8(RFU1)*; U1 3(NC)

## Notes on the sheet
- Power
- Backlight
- Core
- 3.3V
- ESC
- F1
- F2
- F3
- F4
- F5
- F6
- F7
- F8
- F9
- F10
- F11
- F12
- PS
- Scroll Lock
- PAUSE
- 3.42V
- Hot!!!
- `
- !1
- @2
- #3
- $4
- %5
- ^6
- &7
- *8
- (9
- )0
- -_
- +=
- BACK
- INS
- HOME
- PGUP
- Debug
- I2C
- 预留I2C
- TAB
- Q
- W
- E
- R
- T
- Y
- U
- I
- O
- P
- [{
- ]}
- \¦
- DEL
- END
- PgDn
- A
- S
- D
- F
- G
- H
- J
- K
- L
- :;
- "'
- ENTER2
- Matrix_keyboard
- ESC
- F1
- F2
- F3
- F4
- F5
- `
- 1!
- 2@
- 3#
- 4$
- 5%
- SHIFT_1
- Z
- X
- C
- V
- B
- N
- M
- ,<
- .>
- /?
- Shift_R
- UP
- Tab
- Q
- W
- E
- R
- T
- Cap Locks
- A
- S
- D
- F
- G
- Shift-L
- Z
- X
- C
- V
- B
- Ctrl-L
- Win-L
- Alt-L
- Space
- Alt-R
- Fn
- F6
- F7
- F8
- F9
- F10
- F11
- F12
- LFT
- DOW
- RIGHT
- 6^
- 7&
- 8*
- 9(
- 0)
- -_
- +=
- CTRL-L
- WIN-L
- ALT-L
- SPAC
- ALT-R
- Fn
- WIN-R
- CTRL-R
- Y
- U
- I
- O
- P
- [{
- ]}
- H
- J
- K
- L
- ;:
- '"
- \¦
- 键盘指示灯
- N
- M
- ,<
- .>
- /?
- Shift-R
- Win-R
- Ctrl-R
- Num
- Caps-Lock
- Print-screen
- Scroll-Lock
- Pause
- Scroll-Lock
- Backspace
- Insert
- Home
- Page-Up
- Delete
- End
- Page-Down
- Enter
- 上
- 左
- 下
- 右
